# Altium schematic sheet Gyro Accel Temp MPU6050.SchDoc
size A
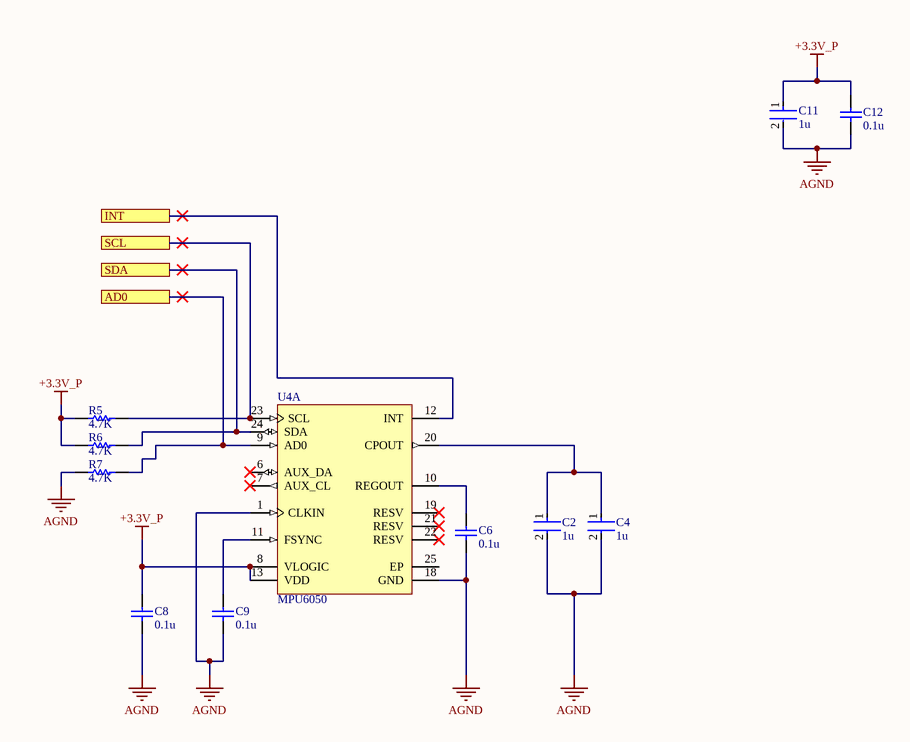
[diagram p0: Gyro Accel Temp MPU6050.SchDoc]

## Parts
C2  1u  [FP-CL31-IPC_B]
C4  1u  [FP-CL31-IPC_B]
C6  0.1u  [CAPC1206(3216)130_M]
C8  0.1u  [CAPC1206(3216)130_M]
C9  0.1u  [CAPC1206(3216)130_M]
C11  1u  [FP-CL31-IPC_B]
C12  0.1u  [CAPC1206(3216)130_M]
R5  4.7K  [RESC3216X70X50LL05T20]
R6  4.7K  [RESC3216X70X50LL05T20]
R7  4.7K  [RESC3216X70X50LL05T20]
U4  MPU6050  [INSE-QFN-24_V]  (part A of 2)

## Ports
AD0, INT, SCL, SDA

## Nets
+3.3V_P: C8.2 C11.1 C12.2 R5.1 R6.1 U4.8(VLOGIC) U4.13(VDD)
AGND: C2.2 C4.2 C6.1 C8.1 C9.1 C11.2 C12.1 R7.1 U4.1(CLKIN) U4.18(GND)
AD0: R7.2 U4.9(AD0) ; port AD0
INT: U4.12(INT) ; port INT
SCL: R5.2 U4.23(SCL) ; port SCL
SDA: R6.2 U4.24(SDA) ; port SDA
NetC2_1: C2.1 C4.1 U4.20(CPOUT)
NetC6_2: C6.2 U4.10(REGOUT)
NetC9_2: C9.2 U4.11(FSYNC)

Not connected (* = marked no-connect by the designer): U4 6(AUX_DA)* 7(AUX_CL)* 19(RESV)* 21(RESV)* 22(RESV)* 25(EP)

## Library data of the parts
C2 C4 C11 = CMP-13271-001662-1: Cap Ceramic 1uF 50V X7R ±10% SMD 1206 +125°C Embossed T/R; Case Code (Metric): 3216; Packaging: Tape and Reel; Depth: 1.6mm; Max Operating Temperature: 125°C; Length: 3.2mm; Contact Plating: Tin; Voltage Rating (DC): 50V; Radiation Hardening: No; Min Operating Temperature: -55°C; Dielectric: X7R; Voltage: 50V; Lead Free: Lead Free; Capacitance: 1uF; Package Quantity: 1; Material: Ceramic; Thickness: 0.071inch; Width: 0.063inch; Voltage Rating: 50V; Case Code (Imperial): 1206; Mount: Surface Mount; Case/Package: 1206; Tolerance: 10%; Height: 1.6mm
C6 C8 C9 C12 = CMP-1037-04215-1: CAP 100nF 100V ±20% 1206 (3216 Metric) Thickness 1.3mm SMD; Case-EIA: 1206; Tolerance: Â±20%; Case-Metric: 3216; Rated Voltage: 100 V; Max Thickness: 1.3 mm; Technology: SMT; Value: 100nF
R5-R7 = CMP-2003-00848-1: Part Number: ERJ8ENF4701V; Manufacturer: Panasonic
U4 = CMP-1753-00002-1: 3-Axis Gyroscope, 3-Axis Accelerometer / , 2.375 to 3.46 V, -40 to 105 degC, 24-Pin QFN, RoHS, Tape and Reel; Resistance: 5.6 kohm; Tolerance: 1%; Voltage Rating: 75 V; Power Rating: 100 mW; ComponentLink1Description: Manufacturer URL; Mount: Surface Mount; Max Operating Temperature: 155degC; Package Quantity: 5000; ComponentLink2Description: Datasheet; Pins: 2; Packaging: Tape and Reel; Case Code (Imperial): 0603; PackageReference: QFN-24; ComponentLink2URL: https://datasheet.ciiva.com/1513/1788002-1513632.pdf; Radiation Hardening: No; ComponentLink1URL: http://www.invensense.com/; PackageDescription: 24-Pin Quad Flat No-lead Package, Body 4 x 4 mm, Pitch 0.5 mm; Height: 0.45 mm; Case/Package: 0603; Case Code (Metric): 1608; REACH SVHC: Yes; Min Operating Temperature: -55degC; DatasheetVersion: Rev. 3.4, 08/2013; Width: 0.8 mm; RoHSCompliant: True; Length: 1.6 mm